# Altium project keyboard.PrjPcb
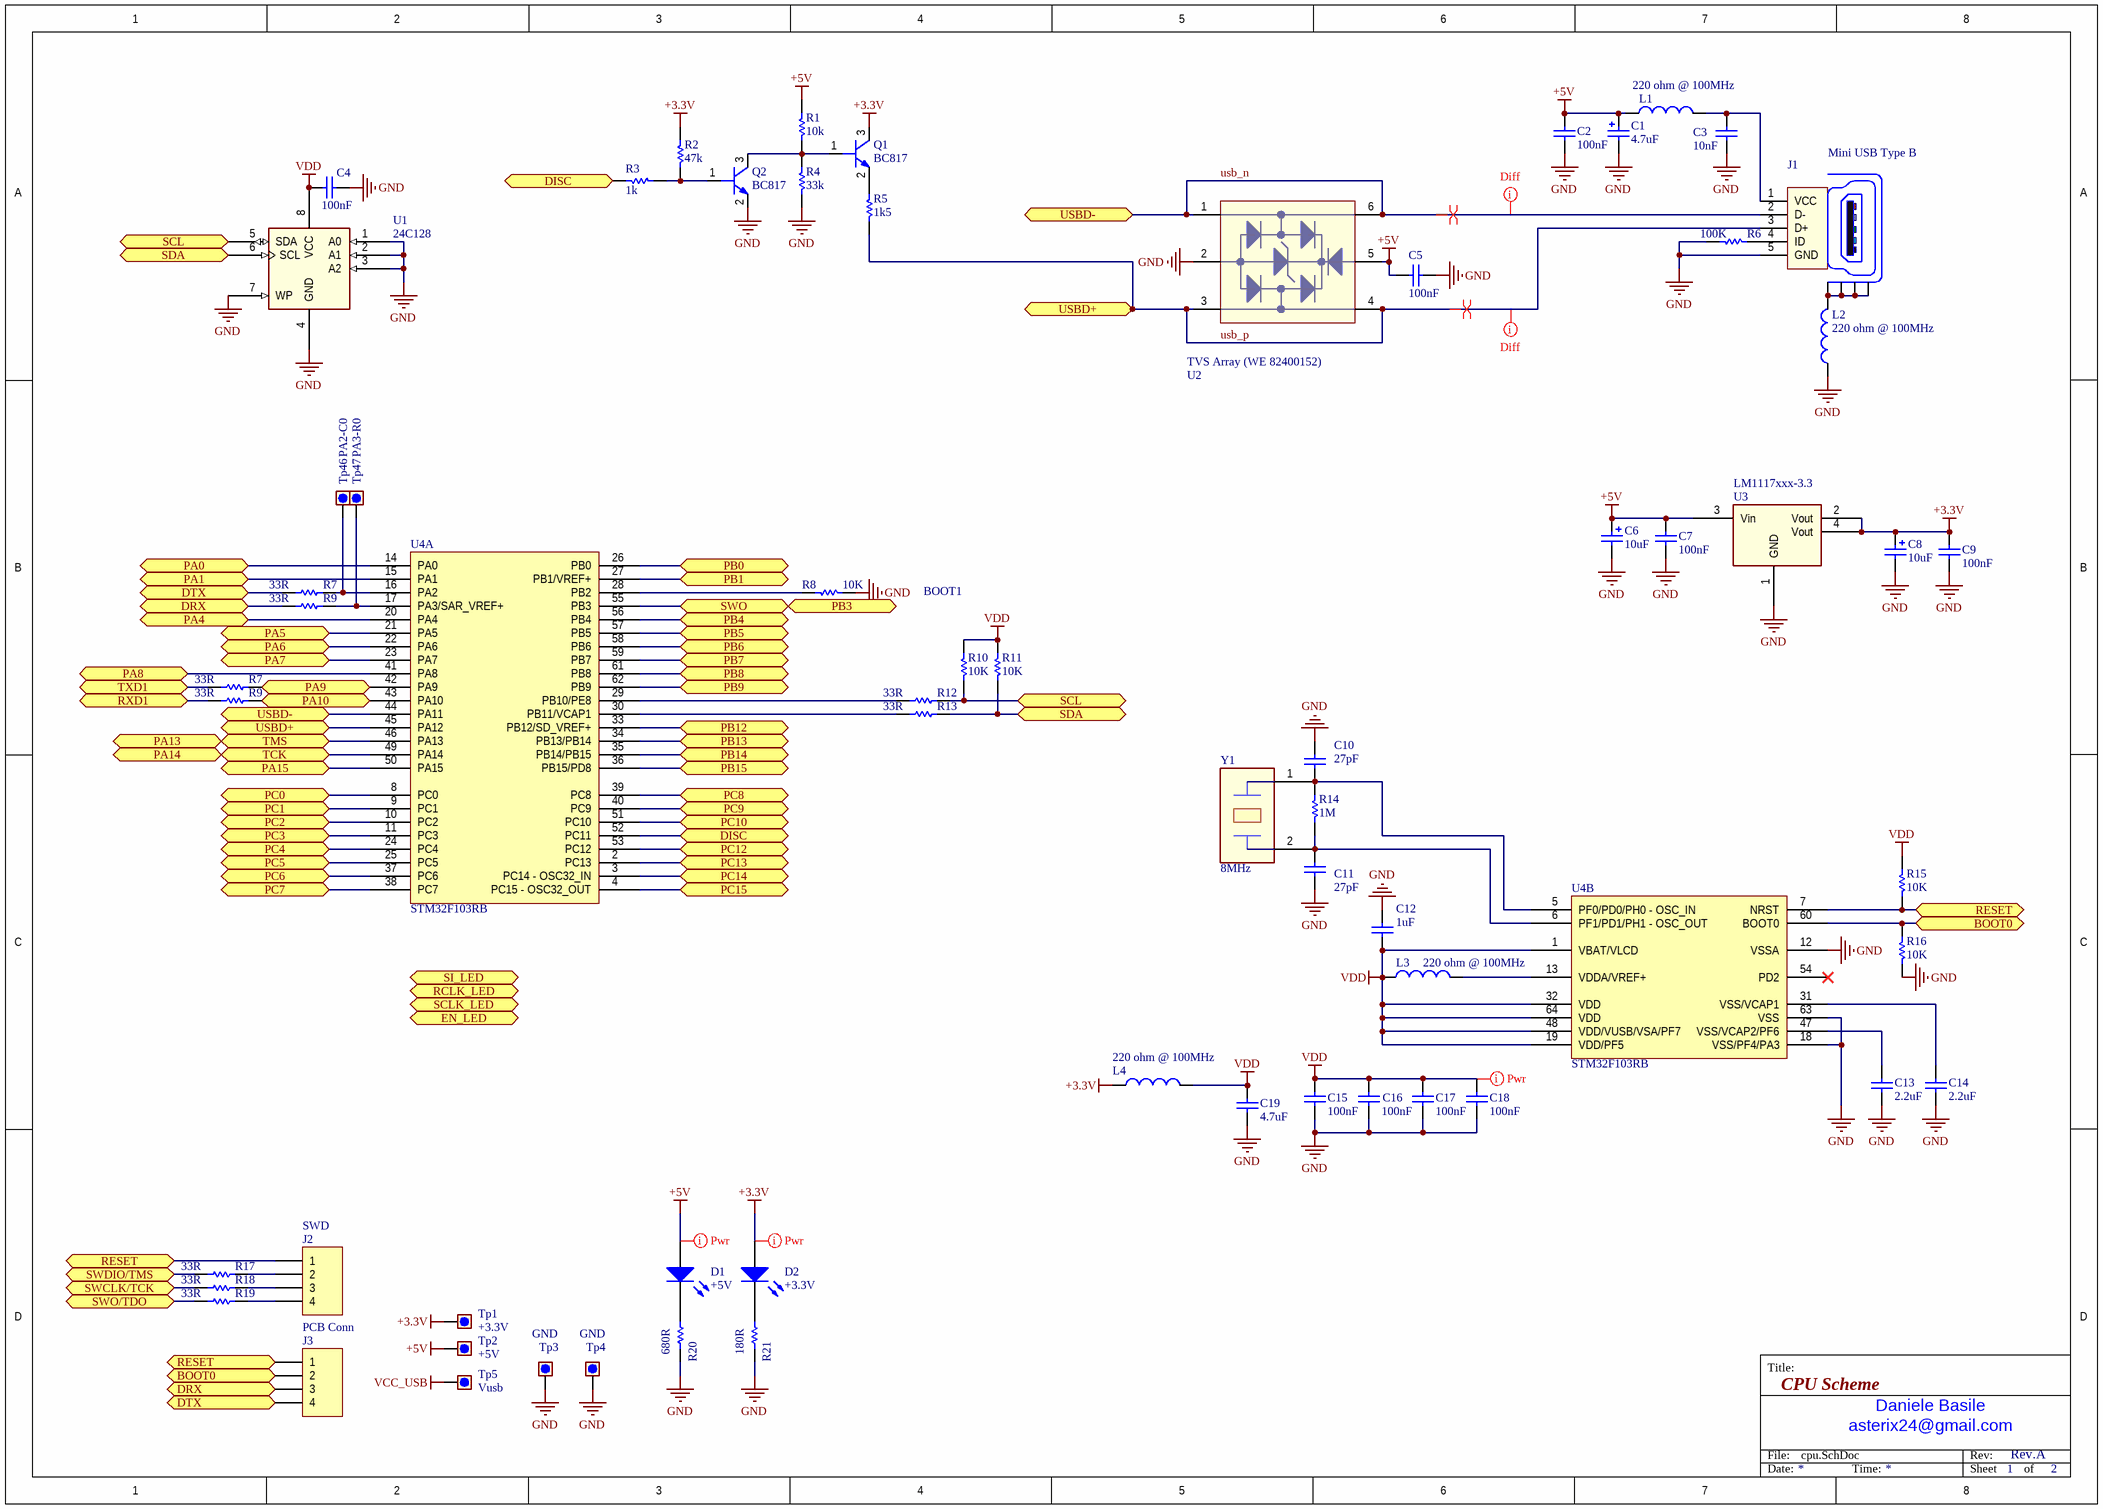
[diagram p0: cpu.SchDoc]
2 sheets, 185 parts. Net scope: flat (ports and power ports of the same name join across sheets).
Board file: keyboard.PcbDoc
Sheets:
  cpu.SchDoc
  keymap.SchDoc

## Sheet cpu.SchDoc: CPU Scheme
size A3; Author: Daniele Basile <asterix24@gmail.com>; Organization: Altium Limited; Address1: L3, 12a Rodborough Rd; Address2: Frenchs Forest; Address3: NSW; Address4: Australia 2086; DocumentNumber: 1; Revision: Rev.A; SheetNumber: 1; SheetTotal: 2

### Parts
(Parts that share a designator on the sheet are numbered #1, #2 ... from top to bottom, then left to right.)
C1  4.7uF  [1206_[3216]]
C2  100nF  [0603_[1608]]
C3  10nF  [0603_[1608]]
C4  100nF  [0603_[1608]]
C5  100nF  [0603_[1608]]
C6  10uF  [1206_[3216]]
C7  100nF  [0603_[1608]]
C8  10uF  [1206_[3216]]
C9  100nF  [0603_[1608]]
C10  27pF  [0603_[1608]]
C11  27pF  [0603_[1608]]
C12  1uF  [0603_[1608]]
C13  2.2uF  [0603_[1608]]
C14  2.2uF  [0603_[1608]]
C15  100nF  [0603_[1608]]
C16  100nF  [0603_[1608]]
C17  100nF  [0603_[1608]]
C18  100nF  [0603_[1608]]
C19  4.7uF  [0603_[1608]]
D1  +5V  [0603_[1608]_LED]
D2  +3.3V  [0603_[1608]_LED]
J1  Mini USB Type B  [usb_typeB_mini_smd]
J2  SWD  [HEADER_1X4_2.54MM_THD]
J3  PCB Conn  [HEADER_1X4_2.54MM_THD]
L1  220 ohm @ 100MHz  [0805_[2012]]
L2  220 ohm @ 100MHz  [0805_[2012]]
L3  220 ohm @ 100MHz  [0805_[2012]]
L4  220 ohm @ 100MHz  [0805_[2012]]
Q1  BC817  [SOT-23]
Q2  BC817  [SOT-23]
R1  10k  [0603_[1608]]
R2  47k  [0603_[1608]]
R3  1k  [0603_[1608]]
R4  33k  [0603_[1608]]
R5  1k5  [0603_[1608]]
R6  100K  [0603_[1608]]
R7#1  33R  [0603_[1608]]
R7#2  33R  [0603_[1608]]
R8  10K  [0603_[1608]]
R9#1  33R  [0603_[1608]]
R9#2  33R  [0603_[1608]]
R10  10K  [0603_[1608]]
R11  10K  [0603_[1608]]
R12  33R  [0603_[1608]]
R13  33R  [0603_[1608]]
R14  1M  [0603_[1608]]
R15  10K  [0603_[1608]]
R16  10K  [0603_[1608]]
R17  33R  [0603_[1608]]
R18  33R  [0603_[1608]]
R19  33R  [0603_[1608]]
R20  680R  [0603_[1608]]
R21  180R  [0603_[1608]]
Tp1  +3.3V  [TEST_POINT_THD_D1.8MM]  (no BOM)
Tp2  +5V  [TEST_POINT_THD_D1.8MM]  (no BOM)
Tp3  GND  [TEST_POINT_THD_D1.8MM]  (no BOM)
Tp4  GND  [TEST_POINT_THD_D1.8MM]  (no BOM)
Tp5  Vusb  [TEST_POINT_THD_D1.8MM]  (no BOM)
Tp46  PA2-C0  [TEST_POINT_THD_D1.8MM]  (no BOM)
Tp47  PA3-R0  [TEST_POINT_THD_D1.8MM]  (no BOM)
U1  24C128  [SOIC8]
U2  TVS Array (WE 82400152)  [SOT-563]
U3  LM1117xxx-3.3  [SOT-223]
U4  STM32F103RB  [TSQFP50P1200X1200X160-64N]  (parts A,B of 2)
Y1  8MHz  [CRYSTAL_HC49UP]

### Ports
BOOT0, DISC, DRX, DTX, EN_LED, PA0, PA1, PA4, PA5, PA6, PA7, PA8, PA9, PA10, PA13, PA14, PA15, PB0, PB1, PB3, PB4, PB5, PB6, PB7, PB8, PB9, PB12, PB13, PB14, PB15, PC0, PC1, PC2, PC3, PC4, PC5, PC6, PC7, PC8, PC9, PC10, PC12, PC13, PC14, PC15, RCLK_LED, RESET, RXD1, SCL, SCLK_LED, SDA, SI_LED, SWCLK/TCK, SWDIO/TMS, SWO, SWO/TDO, TCK, TMS, TXD1, USBD+, USBD-

### Nets
+3.3V: C8.1 C9.2 D2.1(A) L4.1 Q1.3(C) R2.1 Tp1.1 U3.2(Vout) U3.4(Vout)
+5V: C1.1 C2.1 C5.2 C6.1 C7.2 D1.1(A) L1.1 R1.1 Tp2.1 U2.5 U3.3(Vin)
GND: C1.2 C2.2 C3.2 C4.1 C5.1 C6.2 C7.1 C8.2 C9.1 C10.2 C11.2 C12.2 C13.1 C14.1 C15.2 C16.2 C17.2 C18.2 C19.1 J1.5(GND) L2.1 Q2.2(E) R4.2 R6.2 R8.2 R16.1 R20.1 R21.1 Tp3.1 Tp4.1 U1.1(A0) U1.2(A1) U1.3(A2) U1.4(GND) U1.7(WP) U2.2 U3.1(GND) U4.12(VSSA) U4.18(VSS/PF4/PA3) U4.63(VSS)
VCC_USB: Tp5.1
VDD: C4.2 C12.1 C15.1 C16.1 C17.1 C18.1 C19.2 L3.1 L4.2 R10.2 R11.2 R15.1 U1.8(VCC) U4.1(VBAT/VLCD) U4.19(VDD/PF5) U4.32(VDD) U4.48(VDD/VUSB/VSA/PF7) U4.64(VDD)
BOOT0: J3.2 R16.2 U4.60(BOOT0) ; port BOOT0
DISC: R3.2 U4.52(PC11) ; port DISC
DRX: J3.3 R9#1.2 ; port DRX
DTX: J3.4 R7#1.2 ; port DTX
PA0: U4.14(PA0) ; port PA0
PA1: U4.15(PA1) ; port PA1
PA4: U4.20(PA4) ; port PA4
PA5: U4.21(PA5) ; port PA5
PA6: U4.22(PA6) ; port PA6
PA7: U4.23(PA7) ; port PA7
PA8: U4.41(PA8) ; port PA8
PA9: R7#2.1 U4.42(PA9) ; port PA9
PA10: R9#2.1 U4.43(PA10) ; port PA10
PA13: U4.46(PA13) ; port TMS, port PA13
PA14: U4.49(PA14) ; port TCK, port PA14
PA15: U4.50(PA15) ; port PA15
PB0: U4.26(PB0) ; port PB0
PB1: U4.27(PB1/VREF+) ; port PB1
PB3: U4.55(PB3) ; port SWO, port PB3
PB4: U4.56(PB4) ; port PB4
PB5: U4.57(PB5) ; port PB5
PB6: U4.58(PB6) ; port PB6
PB7: U4.59(PB7) ; port PB7
PB8: U4.61(PB8) ; port PB8
PB9: U4.62(PB9) ; port PB9
PB12: U4.33(PB12/SD_VREF+) ; port PB12
PB13: U4.34(PB13/PB14) ; port PB13
PB14: U4.35(PB14/PB15) ; port PB14
PB15: U4.36(PB15/PD8) ; port PB15
PC0: U4.8(PC0) ; port PC0
PC1: U4.9(PC1) ; port PC1
PC2: U4.10(PC2) ; port PC2
PC3: U4.11(PC3) ; port PC3
PC4: U4.24(PC4) ; port PC4
PC5: U4.25(PC5) ; port PC5
PC6: U4.37(PC6) ; port PC6
PC7: U4.38(PC7) ; port PC7
PC8: U4.39(PC8) ; port PC8
PC9: U4.40(PC9) ; port PC9
PC10: U4.51(PC10) ; port PC10
PC12: U4.53(PC12) ; port PC12
PC13: U4.2(PC13) ; port PC13
PC14: U4.3(PC14_-_OSC32_IN) ; port PC14
PC15: U4.4(PC15_-_OSC32_OUT) ; port PC15
RESET: J2.1 J3.1 R15.2 U4.7(NRST) ; port RESET
RXD1: R9#2.2 ; port RXD1
SCL: R10.1 R12.1 U1.5(SDA) ; port SCL
SDA: R11.1 R13.1 U1.6(SCL) ; port SDA
SWCLK/TCK: R18.2 ; port SWCLK/TCK
SWDIO/TMS: R17.2 ; port SWDIO/TMS
SWO/TDO: R19.2 ; port SWO/TDO
TXD1: R7#2.2 ; port TXD1
usb_n: J1.2(D-) U2.1 U2.6 U4.44(PA11) ; port USBD-
usb_p: J1.3(D+) R5.2 U2.3 U2.4 U4.45(PA12) ; port USBD+
NetC3_1: C3.1 J1.1(VCC) L1.2
NetC10_1: C10.1 R14.2 U4.5(PF0/PD0/PH0_-_OSC_IN) Y1.1
NetC11_1: C11.1 R14.1 U4.6(PF1/PD1/PH1_-_OSC_OUT) Y1.2
NetC13_2: C13.2 U4.47(VSS/VCAP2/PF6)
NetC14_2: C14.2 U4.31(VSS/VCAP1)
NetD1_2: D1.2(K) R20.2
NetD2_2: D2.2(K) R21.2
NetJ1_4: J1.4(ID) R6.1
NetJ1_Z1: J1.Z1(Shield) J1.Z2(Shield) J1.Z3(Shield) J1.Z4(Shield) L2.2
NetJ2_2: J2.2 R17.1
NetJ2_3: J2.3 R18.1
NetJ2_4: J2.4 R19.1
NetL3_2: L3.2 U4.13(VDDA/VREF+)
NetQ1_1: Q1.1(B) Q2.3(C) R1.2 R4.1
NetQ1_2: Q1.2(E) R5.1
NetQ2_1: Q2.1(B) R2.2 R3.1
NetR7#1_1: R7#1.1 Tp46.1 U4.16(PA2)
NetR8_1: R8.1 U4.28(PB2)
NetR9#1_1: R9#1.1 Tp47.1 U4.17(PA3/SAR_VREF+)
NetR12_2: R12.2 U4.29(PB10/PE8)
NetR13_2: R13.2 U4.30(PB11/VCAP1)

Not connected (* = marked no-connect by the designer): U4 54(PD2)*

### Layout directives
net class Power: +3.3V, +5V, VDD
net class usb_diff: usb_n, usb_p
differential pair: usb_n, usb_p

### Notes on the sheet
- BOOT1
- Title:
- File:
- asterix24@gmail.com
- Daniele Basile
- Rev:
- Date:
- Time:
- Sheet
- of

### Library data of the parts
C1 = Cap Pol1: Ceramic X7R 16V; Value: 10uF; Published: 8-Jun-2000; Revision: July-2002: Re-released for DXP Platform.; Publisher: Altium Limited
C2 C4 C15-C18 = Cap: Ceramic X7R 50V; Value: 10nF; Published: 8-Jun-2000; Revision: July-2002: Re-released for DXP Platform.; Publisher: Altium Limited
C3 = Cap: Ceramic X7R 50V; Published: 8-Jun-2000; Revision: July-2002: Re-released for DXP Platform.; Publisher: Altium Limited; Value: 10nF
C5 C7 C9 = Cap: Ceramic X7R 50V; Value: 100pF; Published: 8-Jun-2000; LatestRevisionDate: 17-Jul-2002; LatestRevisionNote: Re-released for DXP Platform.; PackageReference: RAD-0.3; Publisher: Altium Limited; PackageDescription: Radial Cap, Thru-Hole; 2 Leads; 0.3 in Pin Spacing
C6 C8 = Cap Pol1: Ceramic X5R 25V; Published: 8-Jun-2000; Revision: July-2002: Re-released for DXP Platform.; Publisher: Altium Limited; Value: 10uF
C10 C11 = Cap: Ceramic NP0 +/- 0.1; Value: 10nF; Published: 8-Jun-2000; Revision: July-2002: Re-released for DXP Platform.; Publisher: Altium Limited
C12 C19 = Cap: Ceramic X7R 16V; Value: 10nF; Published: 8-Jun-2000; Revision: July-2002: Re-released for DXP Platform.; Publisher: Altium Limited
C13 C14 = Cap: Ceramic 6.3V X7R; Value: 10nF; Published: 8-Jun-2000; Revision: July-2002: Re-released for DXP Platform.; Publisher: Altium Limited
D1 D2 = LED0: LED Green; Published: 8-Jun-2000; LatestRevisionDate: 08-Jul-2005; LatestRevisionNote: Mech Layer 1 removed.; PackageReference: LED-0; Publisher: Altium Limited; PackageDescription: LED; 2 Leads
J1 = USB_Con_Type_B_mini_SMT: Mini USB SMT Type B 5 Contacts; Manufacturer: Würth Elektronik eiSos GmbH; partNo: 65100516121; ComponentLink1 Description: Manufacturer; ComponentLink2 Description: Datasheet; NoPins: 5; ComponentLink1URL: http://www.we-online.de; ComponentLink2URL: http://katalog.we-online.de/em/datasheet/65100516121.pdf; Created by: Karrer Zheng; Created Date: 10/10/2014
J2 J3 = Header 4: Pin Header, 1x4, 2.54mm.; LatestRevisionDate: 17-Jul-2002; LatestRevisionNote: Re-released for DXP Platform.; Publisher: Altium Limited
L1 L2 L4 = Inductor: WE 742792022
L3 = Inductor: Value: 100uH; Published: 8-Jun-2000; Revision: July-2002: Re-released for DXP Platform.; Publisher: Altium Limited
Q1 Q2 = BC817: BJT NPN
R1 R2 R4 R5 R7#1 R7#2 R8 R9#1 R9#2 R10-R19 = Res1: Resistor; Value: 1K; Published: 8-Jun-2000; Revision: July-2002: Re-released for DXP Platform.; Publisher: Altium Limited
R3 R20 R21 = Res1: Resistor; Revision: July-2002: Re-released for DXP Platform.
  R3: Published: 8-Jun-2000; Publisher: Altium Limited; Value: 1K
R6 = Resistor_ST: Resistor; Value: 10K
Tp1-Tp5 Tp46 Tp47 = Test_point: Test point
U1 = EEPROM-SOIC8: EEPROM
U2 = TVS_Diode_Array
U3 = LM1117-FIXED-OUT: LM1117 LDO Fixed output
Y1 = CRYSTAL-2p

## Sheet keymap.SchDoc: Keymap Layout
size A3; Author: Daniele Basile <asterix24@gmail.com>; Organization: Altium Limited; Address1: L3, 12a Rodborough Rd; Address2: Frenchs Forest; Address3: NSW; Address4: Australia 2086; DocumentNumber: 2; Revision: Rev.A; SheetNumber: 2; SheetTotal: 2
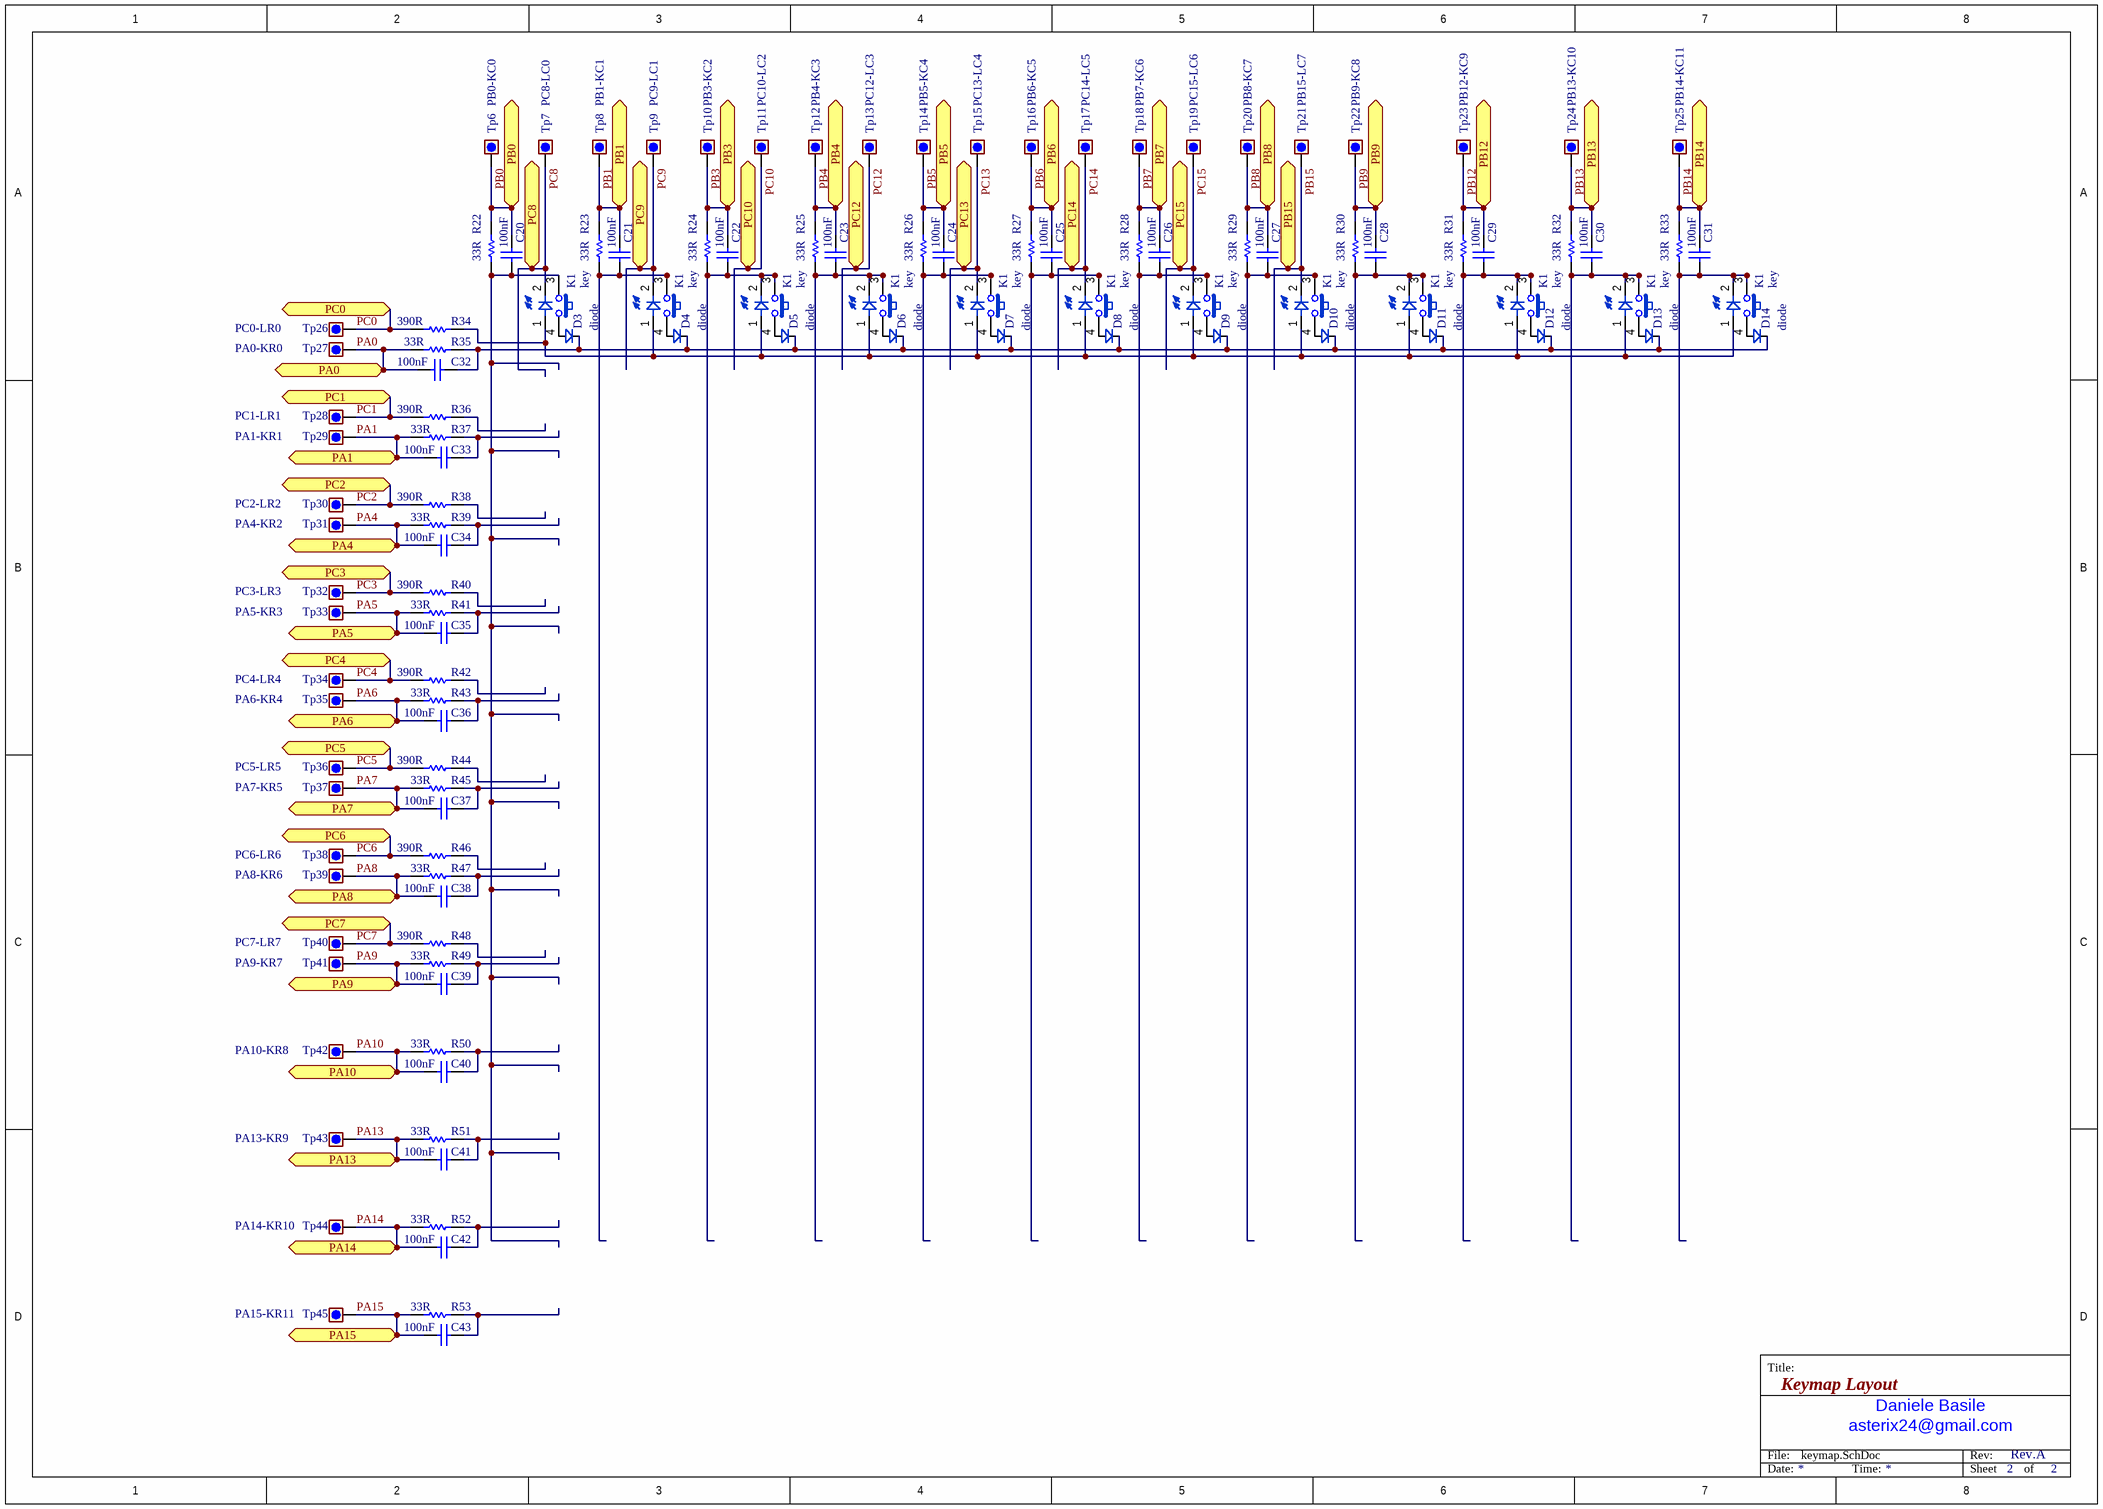
[diagram p1: keymap.SchDoc]

### Parts
(Parts that share a designator on the sheet are numbered #1, #2 ... from top to bottom, then left to right.)
C20  100nF  [0603_[1608]]
C21  100nF  [0603_[1608]]
C22  100nF  [0603_[1608]]
C23  100nF  [0603_[1608]]
C24  100nF  [0603_[1608]]
C25  100nF  [0603_[1608]]
C26  100nF  [0603_[1608]]
C27  100nF  [0603_[1608]]
C28  100nF  [0603_[1608]]
C29  100nF  [0603_[1608]]
C30  100nF  [0603_[1608]]
C31  100nF  [0603_[1608]]
C32  100nF  [0603_[1608]]
C33  100nF  [0603_[1608]]
C34  100nF  [0603_[1608]]
C35  100nF  [0603_[1608]]
C36  100nF  [0603_[1608]]
C37  100nF  [0603_[1608]]
C38  100nF  [0603_[1608]]
C39  100nF  [0603_[1608]]
C40  100nF  [0603_[1608]]
C41  100nF  [0603_[1608]]
C42  100nF  [0603_[1608]]
C43  100nF  [0603_[1608]]
D3  diode
D4  diode
D5  diode
D6  diode
D7  diode
D8  diode
D9  diode
D10  diode
D11  diode
D12  diode
D13  diode
D14  diode
K1#1  key  [CherryMx-switch]
K1#2  key  [CherryMx-switch]
K1#3  key  [CherryMx-switch]
K1#4  key  [CherryMx-switch]
K1#5  key  [CherryMx-switch]
K1#6  key  [CherryMx-switch]
K1#7  key  [CherryMx-switch]
K1#8  key  [CherryMx-switch]
K1#9  key  [CherryMx-switch]
K1#10  key  [CherryMx-switch]
K1#11  key  [CherryMx-switch]
K1#12  key  [CherryMx-switch]
R22  33R  [0603_[1608]]
R23  33R  [0603_[1608]]
R24  33R  [0603_[1608]]
R25  33R  [0603_[1608]]
R26  33R  [0603_[1608]]
R27  33R  [0603_[1608]]
R28  33R  [0603_[1608]]
R29  33R  [0603_[1608]]
R30  33R  [0603_[1608]]
R31  33R  [0603_[1608]]
R32  33R  [0603_[1608]]
R33  33R  [0603_[1608]]
R34  390R  [0603_[1608]]
R35  33R  [0603_[1608]]
R36  390R  [0603_[1608]]
R37  33R  [0603_[1608]]
R38  390R  [0603_[1608]]
R39  33R  [0603_[1608]]
R40  390R  [0603_[1608]]
R41  33R  [0603_[1608]]
R42  390R  [0603_[1608]]
R43  33R  [0603_[1608]]
R44  390R  [0603_[1608]]
R45  33R  [0603_[1608]]
R46  390R  [0603_[1608]]
R47  33R  [0603_[1608]]
R48  390R  [0603_[1608]]
R49  33R  [0603_[1608]]
R50  33R  [0603_[1608]]
R51  33R  [0603_[1608]]
R52  33R  [0603_[1608]]
R53  33R  [0603_[1608]]
Tp6  PB0-KC0  [TEST_POINT_THD_D1.8MM]  (no BOM)
Tp7  PC8-LC0  [TEST_POINT_THD_D1.8MM]  (no BOM)
Tp8  PB1-KC1  [TEST_POINT_THD_D1.8MM]  (no BOM)
Tp9  PC9-LC1  [TEST_POINT_THD_D1.8MM]  (no BOM)
Tp10  PB3-KC2  [TEST_POINT_THD_D1.8MM]  (no BOM)
Tp11  PC10-LC2  [TEST_POINT_THD_D1.8MM]  (no BOM)
Tp12  PB4-KC3  [TEST_POINT_THD_D1.8MM]  (no BOM)
Tp13  PC12-LC3  [TEST_POINT_THD_D1.8MM]  (no BOM)
Tp14  PB5-KC4  [TEST_POINT_THD_D1.8MM]  (no BOM)
Tp15  PC13-LC4  [TEST_POINT_THD_D1.8MM]  (no BOM)
Tp16  PB6-KC5  [TEST_POINT_THD_D1.8MM]  (no BOM)
Tp17  PC14-LC5  [TEST_POINT_THD_D1.8MM]  (no BOM)
Tp18  PB7-KC6  [TEST_POINT_THD_D1.8MM]  (no BOM)
Tp19  PC15-LC6  [TEST_POINT_THD_D1.8MM]  (no BOM)
Tp20  PB8-KC7  [TEST_POINT_THD_D1.8MM]  (no BOM)
Tp21  PB15-LC7  [TEST_POINT_THD_D1.8MM]  (no BOM)
Tp22  PB9-KC8  [TEST_POINT_THD_D1.8MM]  (no BOM)
Tp23  PB12-KC9  [TEST_POINT_THD_D1.8MM]  (no BOM)
Tp24  PB13-KC10  [TEST_POINT_THD_D1.8MM]  (no BOM)
Tp25  PB14-KC11  [TEST_POINT_THD_D1.8MM]  (no BOM)
Tp26  PC0-LR0  [TEST_POINT_THD_D1.8MM]  (no BOM)
Tp27  PA0-KR0  [TEST_POINT_THD_D1.8MM]  (no BOM)
Tp28  PC1-LR1  [TEST_POINT_THD_D1.8MM]  (no BOM)
Tp29  PA1-KR1  [TEST_POINT_THD_D1.8MM]  (no BOM)
Tp30  PC2-LR2  [TEST_POINT_THD_D1.8MM]  (no BOM)
Tp31  PA4-KR2  [TEST_POINT_THD_D1.8MM]  (no BOM)
Tp32  PC3-LR3  [TEST_POINT_THD_D1.8MM]  (no BOM)
Tp33  PA5-KR3  [TEST_POINT_THD_D1.8MM]  (no BOM)
Tp34  PC4-LR4  [TEST_POINT_THD_D1.8MM]  (no BOM)
Tp35  PA6-KR4  [TEST_POINT_THD_D1.8MM]  (no BOM)
Tp36  PC5-LR5  [TEST_POINT_THD_D1.8MM]  (no BOM)
Tp37  PA7-KR5  [TEST_POINT_THD_D1.8MM]  (no BOM)
Tp38  PC6-LR6  [TEST_POINT_THD_D1.8MM]  (no BOM)
Tp39  PA8-KR6  [TEST_POINT_THD_D1.8MM]  (no BOM)
Tp40  PC7-LR7  [TEST_POINT_THD_D1.8MM]  (no BOM)
Tp41  PA9-KR7  [TEST_POINT_THD_D1.8MM]  (no BOM)
Tp42  PA10-KR8  [TEST_POINT_THD_D1.8MM]  (no BOM)
Tp43  PA13-KR9  [TEST_POINT_THD_D1.8MM]  (no BOM)
Tp44  PA14-KR10  [TEST_POINT_THD_D1.8MM]  (no BOM)
Tp45  PA15-KR11  [TEST_POINT_THD_D1.8MM]  (no BOM)

### Ports
PA0, PA1, PA4, PA5, PA6, PA7, PA8, PA9, PA10, PA13, PA14, PA15, PB0, PB1, PB3, PB4, PB5, PB6, PB7, PB8, PB9, PB12, PB13, PB14, PB15, PC0, PC1, PC2, PC3, PC4, PC5, PC6, PC7, PC8, PC9, PC10, PC12, PC13, PC14, PC15

### Nets
PA0: C32.1 R35.1 Tp27.1 ; port PA0
PA1: C33.1 R37.1 Tp29.1 ; port PA1
PA4: C34.1 R39.1 Tp31.1 ; port PA4
PA5: C35.1 R41.1 Tp33.1 ; port PA5
PA6: C36.1 R43.1 Tp35.1 ; port PA6
PA7: C37.1 R45.1 Tp37.1 ; port PA7
PA8: C38.1 R47.1 Tp39.1 ; port PA8
PA9: C39.1 R49.1 Tp41.1 ; port PA9
PA10: C40.1 R50.1 Tp42.1 ; port PA10
PA13: C41.1 R51.1 Tp43.1 ; port PA13
PA14: C42.1 R52.1 Tp44.1 ; port PA14
PA15: C43.1 R53.1 Tp45.1 ; port PA15
PB0: C20.1 R22.1 Tp6.1 ; port PB0
PB1: C21.1 R23.1 Tp8.1 ; port PB1
PB3: C22.1 R24.1 Tp10.1 ; port PB3
PB4: C23.1 R25.1 Tp12.1 ; port PB4
PB5: C24.1 R26.1 Tp14.1 ; port PB5
PB6: C25.1 R27.1 Tp16.1 ; port PB6
PB7: C26.1 R28.1 Tp18.1 ; port PB7
PB8: C27.1 R29.1 Tp20.1 ; port PB8
PB9: C28.1 R30.1 Tp22.1 ; port PB9
PB12: C29.1 R31.1 Tp23.1 ; port PB12
PB13: C30.1 R32.1 Tp24.1 ; port PB13
PB14: C31.1 R33.1 Tp25.1 ; port PB14
PB15: K1#8.2 Tp21.1 ; port PB15
PC0: R34.1 Tp26.1 ; port PC0
PC1: R36.1 Tp28.1 ; port PC1
PC2: R38.1 Tp30.1 ; port PC2
PC3: R40.1 Tp32.1 ; port PC3
PC4: R42.1 Tp34.1 ; port PC4
PC5: R44.1 Tp36.1 ; port PC5
PC6: R46.1 Tp38.1 ; port PC6
PC7: R48.1 Tp40.1 ; port PC7
PC8: K1#1.2 Tp7.1 ; port PC8
PC9: K1#2.2 Tp9.1 ; port PC9
PC10: Tp11.1 ; port PC10
PC12: Tp13.1 ; port PC12
PC13: K1#5.2 Tp15.1 ; port PC13
PC14: K1#6.2 Tp17.1 ; port PC14
PC15: K1#7.2 Tp19.1 ; port PC15
NetC20_2: C20.2 K1#1.3 R22.2
NetC21_2: C21.2 K1#2.3 R23.2
NetC22_2: C22.2 K1#3.2 K1#3.3 R24.2
NetC23_2: C23.2 K1#4.2 K1#4.3 R25.2
NetC24_2: C24.2 K1#5.3 R26.2
NetC25_2: C25.2 K1#6.3 R27.2
NetC26_2: C26.2 K1#7.3 R28.2
NetC27_2: C27.2 K1#8.3 R29.2
NetC28_2: C28.2 K1#9.2 K1#9.3 R30.2
NetC29_2: C29.2 K1#10.2 K1#10.3 R31.2
NetC30_2: C30.2 K1#11.2 K1#11.3 R32.2
NetC31_2: C31.2 K1#12.2 K1#12.3 R33.2
NetC32_2: C32.2 D3.2(K) D4.2(K) D5.2(K) D6.2(K) D7.2(K) D8.2(K) D9.2(K) D10.2(K) D11.2(K) D12.2(K) D13.2(K) D14.2(K) R35.2
NetC33_2: C33.2 R37.2
NetC34_2: C34.2 R39.2
NetC35_2: C35.2 R41.2
NetC36_2: C36.2 R43.2
NetC37_2: C37.2 R45.2
NetC38_2: C38.2 R47.2
NetC39_2: C39.2 R49.2
NetC40_2: C40.2 R50.2
NetC41_2: C41.2 R51.2
NetC42_2: C42.2 R52.2
NetC43_2: C43.2 R53.2
NetD3_1: D3.1(A) K1#1.4
NetD4_1: D4.1(A) K1#2.4
NetD5_1: D5.1(A) K1#3.4
NetD6_1: D6.1(A) K1#4.4
NetD7_1: D7.1(A) K1#5.4
NetD8_1: D8.1(A) K1#6.4
NetD9_1: D9.1(A) K1#7.4
NetD10_1: D10.1(A) K1#8.4
NetD11_1: D11.1(A) K1#9.4
NetD12_1: D12.1(A) K1#10.4
NetD13_1: D13.1(A) K1#11.4
NetD14_1: D14.1(A) K1#12.4
NetK1#1_1: K1#1.1 K1#2.1 K1#3.1 K1#4.1 K1#5.1 K1#6.1 K1#7.1 K1#8.1 K1#9.1 K1#10.1 K1#11.1 K1#12.1 R34.2

Not connected (* = marked no-connect by the designer): R36 2; R38 2; R40 2; R42 2; R44 2; R46 2; R48 2

### Notes on the sheet
- Title:
- File:
- asterix24@gmail.com
- Daniele Basile
- Rev:
- Date:
- Time:
- Sheet
- of

### Library data of the parts
C20-C43 = Cap: Ceramic X7R 50V; Value: 10nF; Published: 8-Jun-2000; Revision: July-2002: Re-released for DXP Platform.; Publisher: Altium Limited
D3-D14 = diode_small
K1#1-K1#12 = keybutton_cherryMX: CherryMx key button.
R22-R53 = Res1: Resistor; Value: 1K; Published: 8-Jun-2000; Revision: July-2002: Re-released for DXP Platform.; Publisher: Altium Limited
Tp6-Tp45 = Test_point: Test point

## Nets that join several sheets
PA0: cpu (U4.14), keymap (C32.1 R35.1 Tp27.1)
PA1: cpu (U4.15), keymap (C33.1 R37.1 Tp29.1)
PA4: cpu (U4.20), keymap (C34.1 R39.1 Tp31.1)
PA5: cpu (U4.21), keymap (C35.1 R41.1 Tp33.1)
PA6: cpu (U4.22), keymap (C36.1 R43.1 Tp35.1)
PA7: cpu (U4.23), keymap (C37.1 R45.1 Tp37.1)
PA8: cpu (U4.41), keymap (C38.1 R47.1 Tp39.1)
PA9: cpu (R7#2.1 U4.42), keymap (C39.1 R49.1 Tp41.1)
PA10: cpu (R9#2.1 U4.43), keymap (C40.1 R50.1 Tp42.1)
PA13: cpu (U4.46), keymap (C41.1 R51.1 Tp43.1)
PA14: cpu (U4.49), keymap (C42.1 R52.1 Tp44.1)
PA15: cpu (U4.50), keymap (C43.1 R53.1 Tp45.1)
PB0: cpu (U4.26), keymap (C20.1 R22.1 Tp6.1)
PB1: cpu (U4.27), keymap (C21.1 R23.1 Tp8.1)
PB3: cpu (U4.55), keymap (C22.1 R24.1 Tp10.1)
PB4: cpu (U4.56), keymap (C23.1 R25.1 Tp12.1)
PB5: cpu (U4.57), keymap (C24.1 R26.1 Tp14.1)
PB6: cpu (U4.58), keymap (C25.1 R27.1 Tp16.1)
PB7: cpu (U4.59), keymap (C26.1 R28.1 Tp18.1)
PB8: cpu (U4.61), keymap (C27.1 R29.1 Tp20.1)
PB9: cpu (U4.62), keymap (C28.1 R30.1 Tp22.1)
PB12: cpu (U4.33), keymap (C29.1 R31.1 Tp23.1)
PB13: cpu (U4.34), keymap (C30.1 R32.1 Tp24.1)
PB14: cpu (U4.35), keymap (C31.1 R33.1 Tp25.1)
PB15: cpu (U4.36), keymap (K1#8.2 Tp21.1)
PC0: cpu (U4.8), keymap (R34.1 Tp26.1)
PC1: cpu (U4.9), keymap (R36.1 Tp28.1)
PC2: cpu (U4.10), keymap (R38.1 Tp30.1)
PC3: cpu (U4.11), keymap (R40.1 Tp32.1)
PC4: cpu (U4.24), keymap (R42.1 Tp34.1)
PC5: cpu (U4.25), keymap (R44.1 Tp36.1)
PC6: cpu (U4.37), keymap (R46.1 Tp38.1)
PC7: cpu (U4.38), keymap (R48.1 Tp40.1)
PC8: cpu (U4.39), keymap (K1#1.2 Tp7.1)
PC9: cpu (U4.40), keymap (K1#2.2 Tp9.1)
PC10: cpu (U4.51), keymap (Tp11.1)
PC12: cpu (U4.53), keymap (Tp13.1)
PC13: cpu (U4.2), keymap (K1#5.2 Tp15.1)
PC14: cpu (U4.3), keymap (K1#6.2 Tp17.1)
PC15: cpu (U4.4), keymap (K1#7.2 Tp19.1)